# Altium schematic sheet Batterie.SchDoc
size A4; SheetNumber: 4; SheetTotal: 4
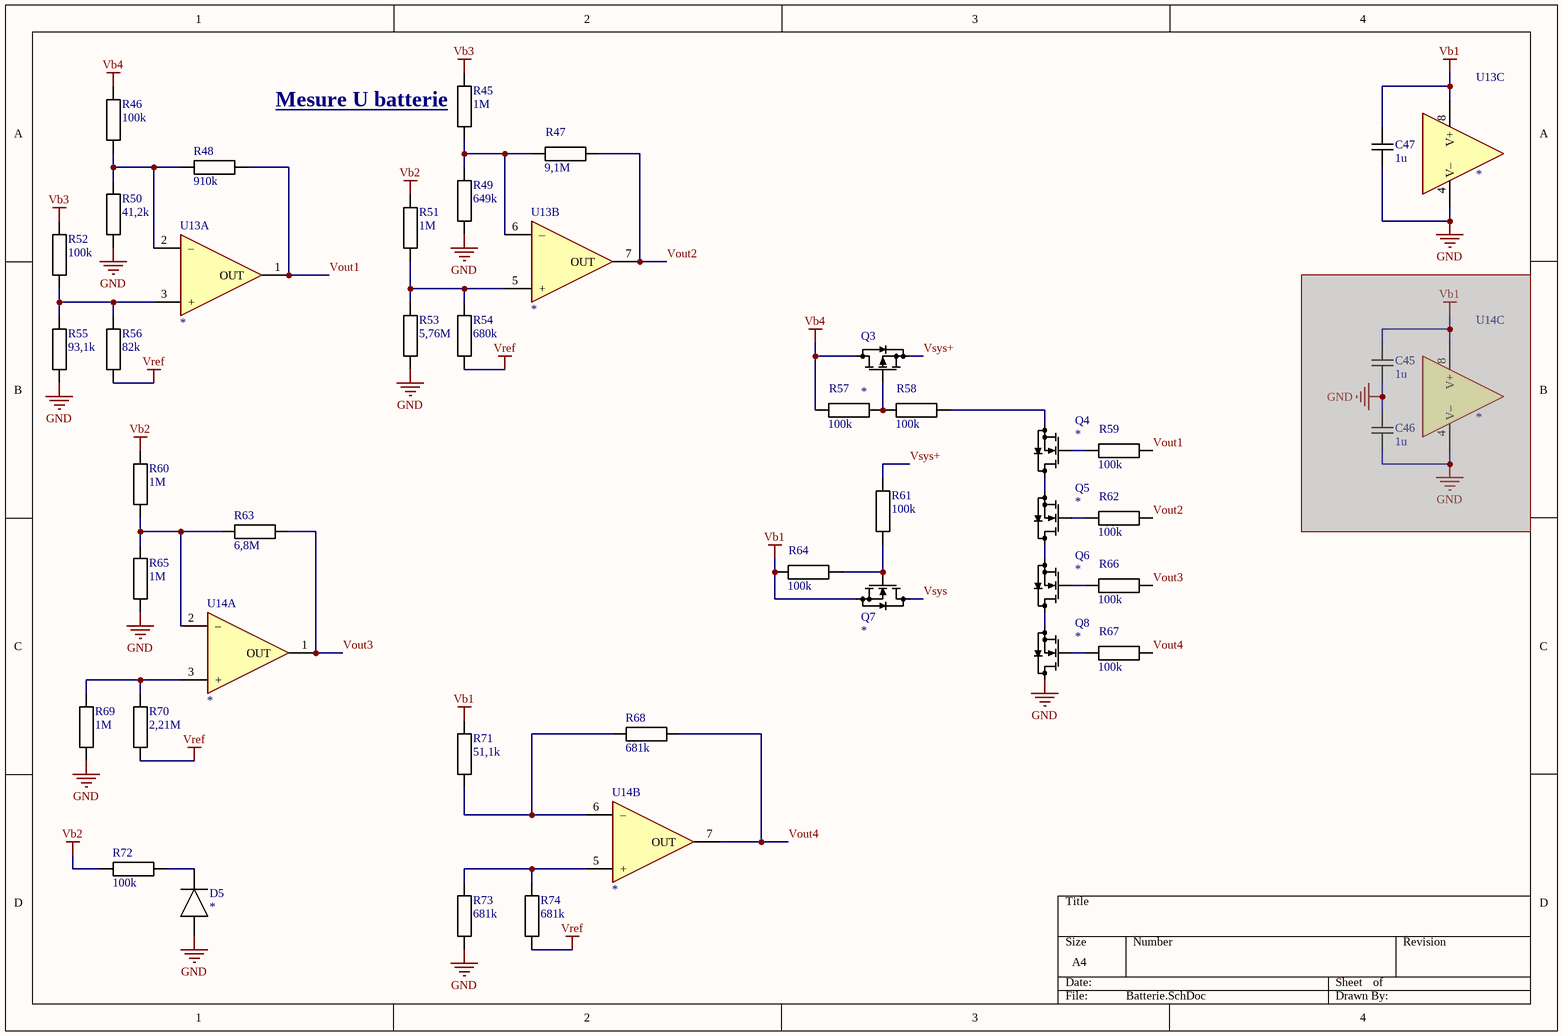
[diagram p0: Batterie.SchDoc]

## Parts
C45  1u  [CAPACITOR 1005 REFLOW]  (masked out: inside a compile mask, not in the netlist)
C46  1u  [CAPACITOR 1005 REFLOW]  (masked out: inside a compile mask, not in the netlist)
C47  1u  [CAPACITOR 1005 REFLOW]
D5  *  [DIODE SOD323 REFLOW]
Q3  *  [SOT23 P0.95 C1.6x3.0 H1.3]
Q4  *  [SOT23 P0.95 C1.6x3.0 H1.3]
Q5  *  [SOT23 P0.95 C1.6x3.0 H1.3]
Q6  *  [SOT23 P0.95 C1.6x3.0 H1.3]
Q7  *  [SOT23 P0.95 C1.6x3.0 H1.3]
Q8  *  [SOT23 P0.95 C1.6x3.0 H1.3]
R45  1M  [RESISTOR 1005 REFLOW]
R46  100k  [RESISTOR 1005 REFLOW]
R47  9,1M  [RESISTOR 1005 REFLOW]
R48  910k  [RESISTOR 1005 REFLOW]
R49  649k  [RESISTOR 1005 REFLOW]
R50  41,2k  [RESISTOR 1005 REFLOW]
R51  1M  [RESISTOR 1005 REFLOW]
R52  100k  [RESISTOR 1005 REFLOW]
R53  5,76M  [RESISTOR 1005 REFLOW]
R54  680k  [RESISTOR 1005 REFLOW]
R55  93,1k  [RESISTOR 1005 REFLOW]
R56  82k  [RESISTOR 1005 REFLOW]
R57  100k  [RESISTOR 1005 REFLOW]
R58  100k  [RESISTOR 1005 REFLOW]
R59  100k  [RESISTOR 1005 REFLOW]
R60  1M  [RESISTOR 1005 REFLOW]
R61  100k  [RESISTOR 1005 REFLOW]
R62  100k  [RESISTOR 1005 REFLOW]
R63  6,8M  [RESISTOR 1005 REFLOW]
R64  100k  [RESISTOR 1005 REFLOW]
R65  1M  [RESISTOR 1005 REFLOW]
R66  100k  [RESISTOR 1005 REFLOW]
R67  100k  [RESISTOR 1005 REFLOW]
R68  681k  [RESISTOR 1005 REFLOW]
R69  1M  [RESISTOR 1005 REFLOW]
R70  2,21M  [RESISTOR 1005 REFLOW]
R71  51,1k  [RESISTOR 1005 REFLOW]
R72  100k  [RESISTOR 1005 REFLOW]
R73  681k  [RESISTOR 1005 REFLOW]
R74  681k  [RESISTOR 1005 REFLOW]
U13  *  [SO8 P1.27 C4.0X5.0 H1.75]  (parts A,B,C of 3)
U14  *  [SO8 P1.27 C4.0X5.0 H1.75]  (parts A,B,C of 3)

## Nets
GND: C47.2 D5.2(A) Q8.3(D) R49.1 R50.1 R53.1 R55.1 R65.1 R69.1 R73.1 U13.4(V–)
Vb1: C47.1 Q7.2(S) R64.2 R71.2 U13.8(V+)
Vb2: R51.2 R60.2 R72.2
Vb3: R45.2 R52.2
Vb4: Q3.3(D) R46.2 R57.2
Vref: R54.1 R56.1 R70.1 R74.1
Vout1: R48.1 R59.1 U13.1(OUT)
Vout2: R47.1 R62.1 U13.7(OUT)
Vout3: R63.1 R66.1 U14.1(OUT)
Vout4: R67.1 R68.1 U14.7(OUT)
Vsys: Q7.3(D)
Vsys+: Q3.2(S) R61.2
NetD5_1: D5.1(C) R72.1
NetQ3_1: Q3.1(G) R57.1 R58.2
NetQ4_1: Q4.1(G) R59.2
NetQ4_2: Q4.2(S) R58.1
NetQ4_3: Q4.3(D) Q5.2(S)
NetQ5_1: Q5.1(G) R62.2
NetQ5_3: Q5.3(D) Q6.2(S)
NetQ6_1: Q6.1(G) R66.2
NetQ6_3: Q6.3(D) Q8.2(S)
NetQ7_1: Q7.1(G) R61.1 R64.1
NetQ8_1: Q8.1(G) R67.2
NetR45_1: R45.1 R47.2 R49.2 U13.6(–)
NetR46_1: R46.1 R48.2 R50.2 U13.2(–)
NetR51_1: R51.1 R53.2 R54.2 U13.5(+)
NetR52_1: R52.1 R55.2 R56.2 U13.3(+)
NetR60_1: R60.1 R63.2 R65.2 U14.2(–)
NetR68_2: R68.2 R71.1 U14.6(–)
NetR69_2: R69.2 R70.2 U14.3(+)
NetR73_2: R73.2 R74.2 U14.5(+)

## Notes on the sheet
- (near R45) Mesure U batterie

## Library data of the parts
C45-C47 = Capacitor: Value: 1u
D5 = DIODE: Diode generic 2 leads; Value: *
Q3 = MOS-P SOT23 G-S-D: Generic MOS-P; Value: *
Q4-Q8 = MOS-N SOT23 S-D-G: Generic MOS-N; pin to pad: 1>3 2>1 3>2; Value: *
R45-R74 = Resistor
  R45 R51 R60 R65 R69: Value: 1M
  R46 R52 R57-R59 R61 R62 R64 R66 R67 R72: Value: 100k
  R47: Value: 9,1M
  R48: Value: 910k
  R49: Value: 649k
  R50: Value: 41,2k
  R53: Value: 5,76M
  R54: Value: 680k
  R55: Value: 93,1k
  R56: Value: 82k
  R63: Value: 6,8M
  R68 R73 R74: Value: 681k
  R70: Value: 2,21M
  R71: Value: 51,1k
U13 U14 = OPA DUAL: Generic dual OPA 8 pins; Value: *